# Altium project EUROC mk2 BGA - Componentes teydisa.PrjPcb (part 2 of 2)

## Sheet  Modulos.SchDoc
size A4; SheetNumber: 4; SheetTotal: 4
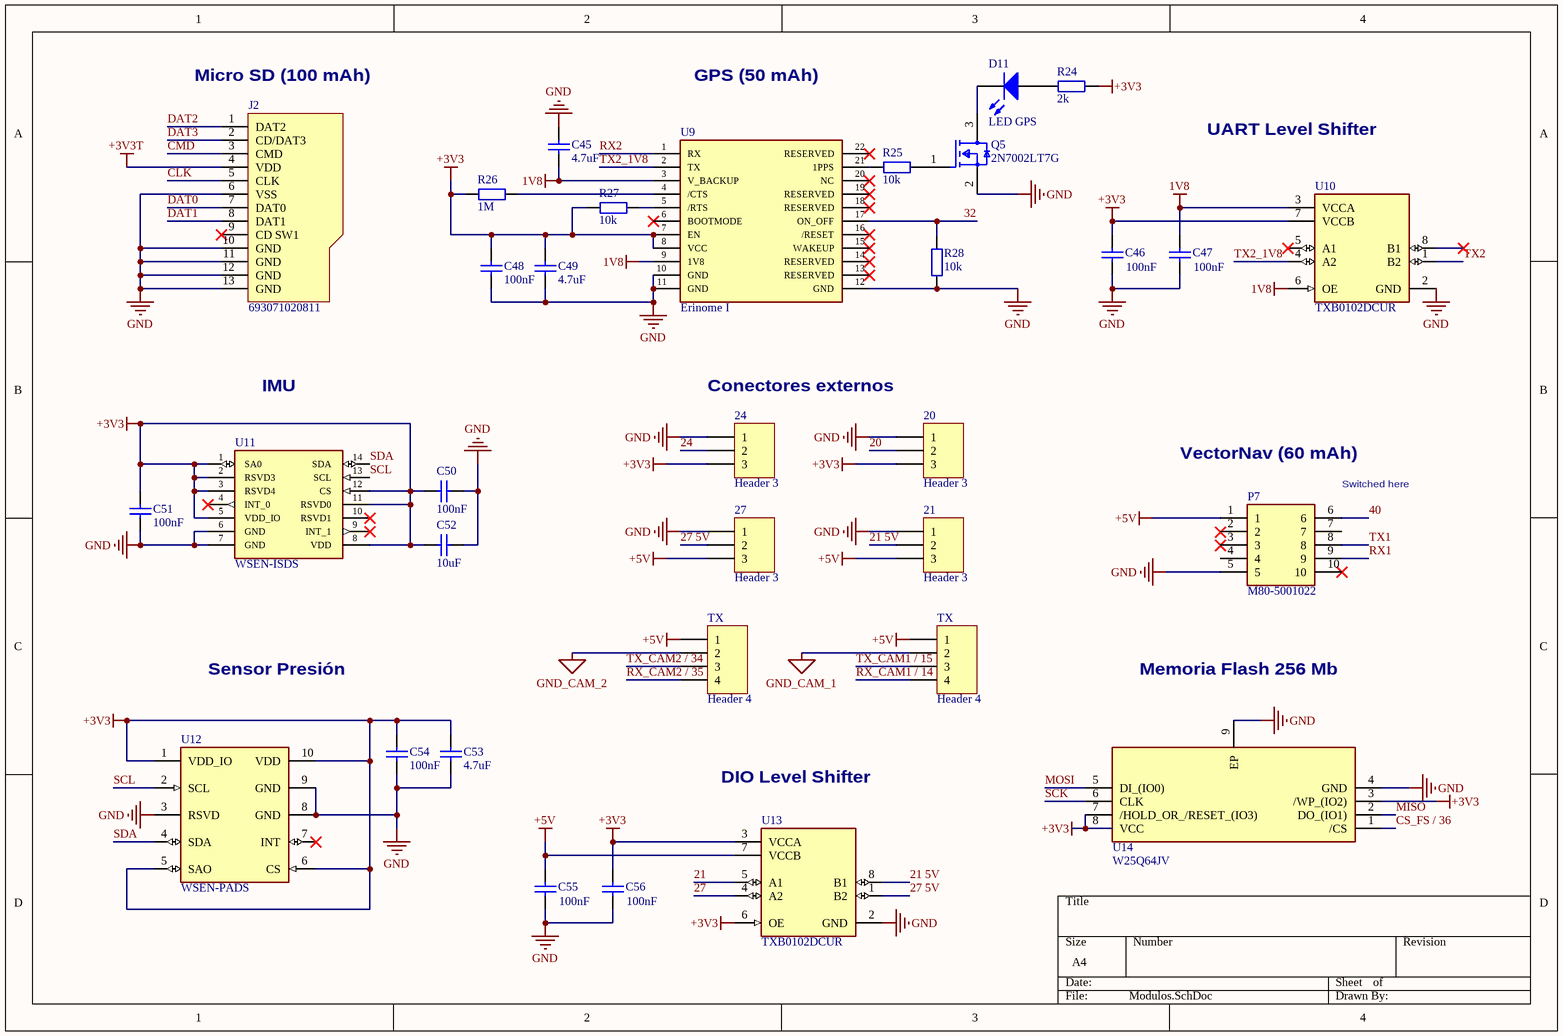
[diagram p3:  Modulos.SchDoc]

### Parts
(Parts that share a designator on the sheet are numbered #1, #2 ... from top to bottom, then left to right.)
20  Header 3  [XH-3-PM]
21  Header 3  [XH-3-PM]
24  Header 3  [XH-3-PM]
27  Header 3  [XH-3-PM]
C45  value 4.7uF  [MY_0603]  (hidden comment: Cap ceramic)
C46  value 100nF  [MY_0603]  (hidden comment: Cap ceramic)
C47  value 100nF  [MY_0603]  (hidden comment: Cap ceramic)
C48  value 100nF  [MY_0603]  (hidden comment: Cap ceramic)
C49  value 4.7uF  [MY_0603]  (hidden comment: Cap ceramic)
C50  value 100nF  [MY_0603]  (hidden comment: Cap ceramic)
C51  value 100nF  [MY_0603]  (hidden comment: Cap ceramic)
C52  value 10uF  [MY_0603]  (hidden comment: Cap ceramic)
C53  value 4.7uF  [MY_0603]  (hidden comment: Cap ceramic)
C54  value 100nF  [MY_0603]  (hidden comment: Cap ceramic)
C55  value 100nF  [MY_0603]  (hidden comment: Cap ceramic)
C56  value 100nF  [MY_0603]  (hidden comment: Cap ceramic)
D11  LED GPS  [MY_LED_0805]
J2  693071020811  [693071020811]
P7  M80-5001022  [M80-50010YY_2]
Q5  2N7002LT7G  [FP-318-IPC_C]
R24  2k  [R0603-0.45]
R25  10k  [R0603-0.45]
R26  1M  [R0603-0.45]
R27  10k  [R0603-0.45]
R28  10k  [R0603-0.45]
TX#1  Header 4  [JST XH]
TX#2  Header 4  [JST XH]
U9  Erinome I  [2614019037001-Footprint-1]
U10  TXB0102DCUR  [FP-DCU0008A-IPC_B]
U11  WSEN-ISDS  [WSEN-ISDS-Footprint-1]
U12  WSEN-PADS  [WSEN-PADS-Footprint-1]
U13  TXB0102DCUR  [FP-DCU0008A-IPC_B]
U14  W25Q64JV  [WSON 8X6]

### Nets
1V8: C45.2 C47.2 U9.3(V_BACKUP) U9.9(1V8) U10.3(VCCA) U10.6(OE)
+3V3: 20.3 24.3 C46.2 C48.1 C49.1 C50.1 C51.1 C52.1 C53.1 C54.1 C56.2 R24.1 R26.1 R27.1 U9.7(EN) U9.8(VCC) U10.7(VCCB) U11.1(SA0) U11.2(RSVD3) U11.3(RSVD4) U11.5(VDD_IO) U11.8(VDD) U11.11(RSVD0) U11.12(CS) U12.1(VDD_IO) U12.5(SAO) U12.6(CS) U12.10(VDD) U13.3(VCCA) U13.6(OE) U14.3(/WP_(IO2)) U14.7(/HOLD_OR_/RESET_(IO3)) U14.8(VCC)
+3V3T: J2.4(VDD)
+5V: 21.3 27.3 C55.2 P7.1 TX#1.1 TX#2.1 U13.7(VCCB)
GND: 20.1 21.1 24.1 27.1 C45.1 C46.1 C47.1 C48.2 C49.2 C50.2 C51.2 C52.2 C53.2 C54.2 C55.1 C56.1 J2.6(VSS) J2.10(GND) J2.11(GND) J2.12(GND) J2.13(GND) P7.5 Q5.2(Source) R28.2 U9.10(GND) U9.11(GND) U9.12(GND) U10.2(GND) U11.6(GND) U11.7(GND) U12.3(RSVD) U12.8(GND) U12.9(GND) U13.2(GND) U14.4(GND) U14.9(EP)
GND_CAM_1: TX#2.2
GND_CAM_2: TX#1.2
20: 20.2
21: U13.5(A1)
21 5V: 21.2 U13.8(B1)
24: 24.2
27: U13.4(A2)
27 5V: 27.2 U13.1(B2)
32: R28.1 U9.17(ON_OFF)
40: P7.6
CLK: J2.5(CLK)
CMD: J2.3(CMD)
CS_FS / 36: U14.1(/CS)
DAT0: J2.7(DAT0)
DAT1: J2.8(DAT1)
DAT2: J2.1(DAT2)
DAT3: J2.2(CD/DAT3)
MISO: U14.2(DO_(IO1))
MOSI: U14.5(DI_(IO0))
RX1: P7.9
RX2: U9.1(RX)
RX_CAM1 / 14: TX#2.4
RX_CAM2 / 35: TX#1.4
SCK: U14.6(CLK)
SCL: U11.13(SCL) U12.2(SCL)
SDA: U11.14(SDA) U12.4(SDA)
TX1: P7.8
TX2: U10.1(B2)
TX2_1V8: U9.2(TX) U10.4(A2)
TX_CAM1 / 15: TX#2.3
TX_CAM2 / 34: TX#1.3
NetD11_A: D11.A R24.2
NetD11_K: D11.K Q5.3(Drain)
NetQ5_1: Q5.1(Gate) R25.1
NetR25_2: R25.2 U9.21(1PPS)
NetR26_2: R26.2 U9.4(/CTS)
NetR27_2: R27.2 U9.5(/RTS)

Not connected (* = marked no-connect by the designer): J2 9(CD_SW1_)*; P7 2 3* 4 7 10*; U9 6(BOOTMODE)* 13(RESERVED)* 14(RESERVED)* 15(WAKEUP)* 16(/RESET)* 18(RESERVED)* 19(RESERVED)* 20(NC)* 22(RESERVED)*; U10 5(A1)* 8(B1)*; U11 4(INT_0)* 9(INT_1)* 10(RSVD1)*; U12 7(INT)*

### Notes on the sheet
- (near J2) Micro SD (100 mAh)
- GPS (50 mAh)
- UART Level Shifter
- IMU
- (near 24) Conectores externos
- VectorNav (60 mAh)
- (near P7) Switched here
- Sensor Presión
- Memoria Flash 256 Mb
- DIO Level Shifter

### Library data of the parts
20 21 24 27 = CMP-016-000017-2: Header, 3-Pin; ASiD Part Number: Header 3-AS; Signal Integrity: Connector; Design Item ID: Header 3; Source: PCB_Project1.SCHLIB; Component Type: Standard; Pin Count: 3
C45-C56 = CMP-015-000000-1: None polar capacitor; ASiD Part Number: C-AS; Source: PCB_Project1.SCHLIB; Pin Count: 2; Design Item ID: Cap ceramic; Component Type: Standard
D11 = CMP-019-000005-1: Typical INFRARED GaAs LED; ASiD Part Number: LED-AS; Pin Count: 2; Source: PCB_Project1.SCHLIB; Design Item ID: LED; Component Type: Standard
J2 = CMP-002-00279-1: WR-CRD Micro SD Card Connector Push & Push; Manufacturer: Wurth Elektronik; Withstanding Voltage: 500VAC; Gender: Socket; Contact Resistance: 100mOhm; Working Voltage: 30VAC; Rated Current: 0.5A; ComponentLink2URL: https://www.we-online.com/redexpert/spec/693071020811?ad; Manufacturer Part Number: 693071020811; Pin Count: 13; Type: Push & Push; Packaging: Tape and Reel; Mount: Surface Mount; Source: WR-CRD.SchLib; Match Code: WR-CRD; ComponentLink1Description: Website Link; ComponentLink2Description: Datasheet Link; Component Type: Standard; Operating Temperature Min: -40°C; Pins: 8; ComponentLink1URL: https://www.we-online.com/redexpert/article/693071020811?ad; Operating Temperature Max: 85°C; Design Item ID: 693071020811; Category: Input/Output Connectors
P7 = CMP-002-00001-2: Connector; Manufacturer_Name: Harwin; Height: 5.6mm; Design Item ID: M80-5001022; Manufacturer_Part_Number: M80-5001022; Datasheet Link: https://cdn.harwin.com/pdfs/M80-500.pdf; Source: SamacSys.SchLib; Mouser Part Number: 855-M80-5001022; Mouser Price/Stock: https://www.mouser.co.uk/ProductDetail/Harwin/M80-5001022?qs=Epf5S32jonjHqF%252BzRUQhDQ%3D%3D
Q5 = CMP-013-00007-1: Small Signal Field-Effect Transistor, 0.115A I(D), 60V, 1-Element, N-Channel, Silicon, Metal-oxide Semiconductor FET, TO-236
R24-R28 = CMP-009-000000-6: Resistor, generic; Pin Count: 2; Design Item ID: R; Source: Resistors.SchLib; Component Type: Standard
TX#1 TX#2 = CMP-016-000019-4: Header, 4-Pin; ASiD Part Number: Header 4-AS; Signal Integrity: Connector; Design Item ID: Header 4; Source: PCB_Project1.SCHLIB; Pin Count: 4; Component Type: Standard
U9 = CMP-00025-00002-3: GPSS, Galileo, Beidou & Glonass Rohs Compliant: Yes
U10 U13 = CMP-016-00000-1: Interface Circuit, PDSO8; Nominal Supply Voltage: 1.5V; Min Supply Voltage: 1.2V; Max Supply Voltage: 3.6V; Pins: 8; Case/Package: VSSOP; RoHS Compliant: Yes; Min Operating Temperature: -40°C; Max Operating Temperature: 85°C
U11 = CMP-010-00001-1: WSEN-ISDS IMU 6-axis (Inertial measurement unit)
U12 = CMP-010-00002-1: Piezoresistive Sensor, Absolute pressure sensor; RoHS Compliant: Yes
U14 = CMP-078-000000-4: NOR Flash spiFlash, 64M-bit, DTR, 4Kb Uniform Sector; Manufacturer_Part_Number: W25Q64JVXGIM TR; Manufacturer_Name: Winbond; Geometry.Height: 0.5mm; Arrow Part Number: W25Q64JVXGIM TR; Datasheet Link: https://www.winbond.com/resource-files/w25q64jv_dtr%20revj%2003272018%20plus.pdf; Arrow Price/Stock: https://www.arrow.com/en/products/w25q64jvxgim-tr/winbond-electronics?region=nac; Source: W25Q64JVXGIM_TR.SchLib; Mouser Part Number: 454-W25Q64JVXGIMTR; Design Item ID: W25Q64JVXGIM_TR; Mouser Price/Stock: https://www.mouser.co.uk/ProductDetail/Winbond/W25Q64JVXGIM-TR?qs=qSfuJ%252Bfl%2Fd5DYf7S8uijYQ%3D%3D

## Nets that join several sheets
+3V3:  CPU (8 pins),  PMU (5V#1.2 5V#2.2 C24.2 U5.5),  RF (15 pins),  Modulos (33 pins)
+3V3T:  CPU (16 pins),  PMU (8 pins),  Modulos (J2.4)
+5V:  CPU (5 pins),  PMU (5 pins),  Modulos (7 pins)
+5VT:  CPU (U1.N6 U1.P6),  PMU (B1.1 C26.1 C27.1 Q2.2)
GND:  CPU (61 pins),  PMU (26 pins),  RF (30 pins),  Modulos (36 pins)
GND_CAM_1:  PMU (Q3.3),  Modulos (TX#2.2)
GND_CAM_2:  PMU (Q4.3),  Modulos (TX#1.2)
2:  CPU (U1.F2),  PMU (Q4.1 R21.1)
20:  CPU (U1.L13),  Modulos (20.2)
21:  CPU (U1.J13),  Modulos (U13.5)
24:  CPU (U1.K14),  Modulos (24.2)
27:  CPU (U1.J14),  Modulos (U13.4)
28:  CPU (U1.D5),  RF (U6.9)
29:  CPU (U1.C5),  RF (U6.10)
30:  CPU (U1.E4),  RF (U6.7)
31:  CPU (U1.C3),  RF (U6.8)
32:  CPU (U1.C10),  Modulos (R28.1 U9.17)
33:  CPU (U1.H4),  PMU (Q3.1 R20.1)
40:  CPU (U1.L12),  Modulos (P7.6)
ARX / 9:  CPU (U1.A10),  RF (U7.3)
ATX / 6:  CPU (U1.D9),  RF (U7.2)
CLK:  CPU (U1.J3),  Modulos (J2.5)
CMD:  CPU (U1.J4),  Modulos (J2.3)
CS_FS / 36:  CPU (U1.C11),  Modulos (U14.1)
CS_SX / 10:  CPU (U1.D7),  RF (U6.19)
D_N:  CPU (U1.M8),  PMU (D10.4 J3.A7 J3.B7)
D_P:  CPU (U1.L8),  PMU (D10.3 J3.A6 J3.B6)
DAT0:  CPU (U1.J1),  Modulos (J2.7)
DAT1:  CPU (U1.K1),  Modulos (J2.8)
DAT2:  CPU (U1.H2),  Modulos (J2.1)
DAT3:  CPU (U1.J2),  Modulos (J2.2)
FDCAN1_RX:  CPU (U1.M13),  PMU (U5.4)
FDCAN1_TX:  CPU (U1.H13),  PMU (U5.1)
MISO:  CPU (U1.E7),  RF (U6.16),  Modulos (U14.2)
MOSI:  CPU (U1.E8),  RF (U6.17),  Modulos (U14.5)
PMIC_REQ:  CPU (U1.K7),  PMU (B1.3 R17.2)
RX1:  CPU (U1.M11),  Modulos (P7.9)
RX2:  CPU (U1.A11),  Modulos (U9.1)
RX_CAM1 / 14:  CPU (U1.L11),  Modulos (TX#2.4)
RX_CAM2 / 35:  CPU (U1.D13),  Modulos (TX#1.4)
SCK:  CPU (U1.D8),  RF (U6.18),  Modulos (U14.6)
SCL:  CPU (R8.2 U1.J11 U4.4),  Modulos (U11.13 U12.2)
SDA:  CPU (R7.2 U1.K11 U4.2),  Modulos (U11.14 U12.4)
SX_RESET / 3:  CPU (U1.G5),  RF (U6.3)
TX1:  CPU (U1.G11),  Modulos (P7.8)
TX2:  CPU (U1.B11),  Modulos (U10.1)
TX_CAM1 / 15:  CPU (U1.M12),  Modulos (TX#2.3)
TX_CAM2 / 34:  CPU (U1.D14),  Modulos (TX#1.3)